# Altium project MEMC_FFC.PrjPcb
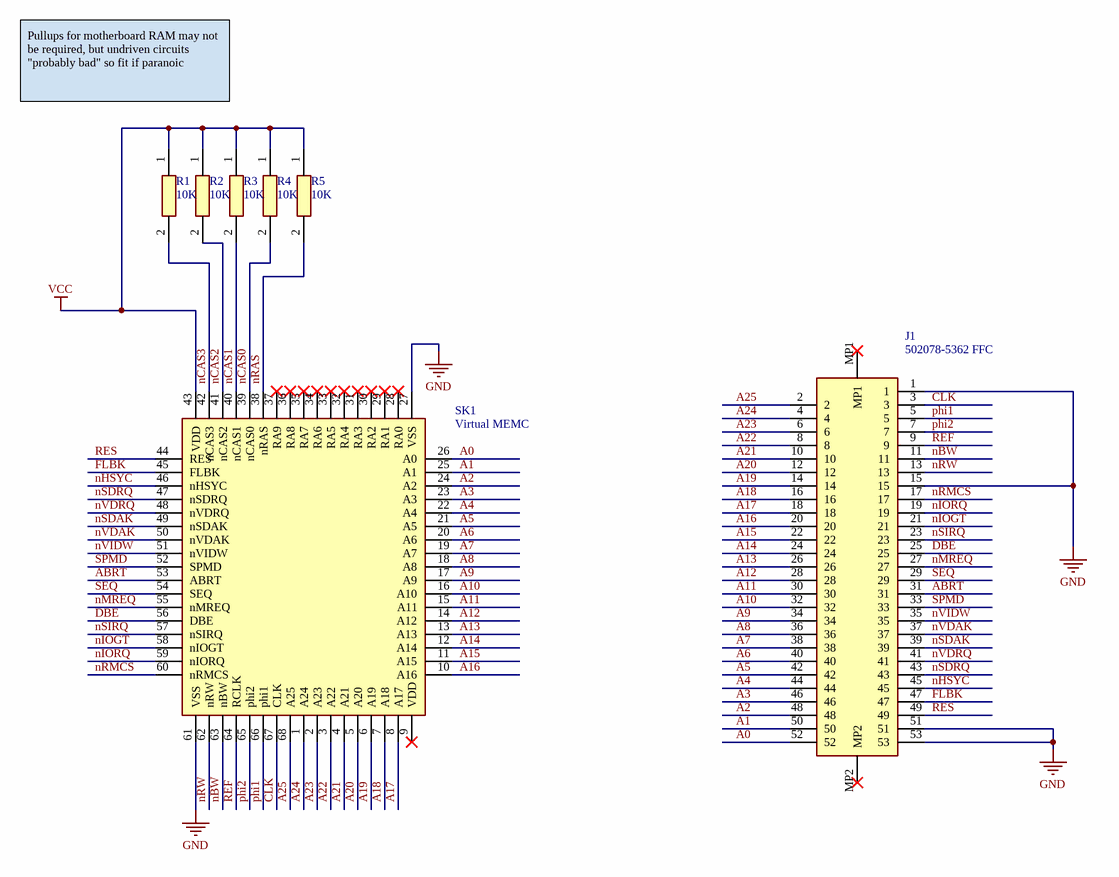
[diagram p0: MEMC_FFC.SchDoc]
Sch_RevNo: 1; Sch_ReleaseDate: 2023; Project_TItle: MEMC_FFC
1 sheet, 7 parts. Net scope: global (net labels, ports and power ports of the same name join across sheets).
Board file: MEMC_FFC.PcbDoc

## Sheet MEMC_FFC.SchDoc
size A3; SheetNumber: 1; SheetTotal: 1

### Parts
J1  502078-5362 FFC  [5020785362]
R1  10K  [RESC1005X40N]
R2  10K  [RESC1005X40N]
R3  10K  [RESC1005X40N]
R4  10K  [RESC1005X40N]
R5  10K  [RESC1005X40N]
SK1  Virtual MEMC  [846821B1RKTR]

### Nets
GND: J1.1 J1.15 J1.51 J1.53 SK1.27(VSS) SK1.61(VSS)
VCC: R1.1 R2.1 R3.1 R4.1 R5.1 SK1.43(VDD)
A0: J1.52 SK1.26(A0)
A1: J1.50 SK1.25(A1)
A2: J1.48 SK1.24(A2)
A3: J1.46 SK1.23(A3)
A4: J1.44 SK1.22(A4)
A5: J1.42 SK1.21(A5)
A6: J1.40 SK1.20(A6)
A7: J1.38 SK1.19(A7)
A8: J1.36 SK1.18(A8)
A9: J1.34 SK1.17(A9)
A10: J1.32 SK1.16(A10)
A11: J1.30 SK1.15(A11)
A12: J1.28 SK1.14(A12)
A13: J1.26 SK1.13(A13)
A14: J1.24 SK1.12(A14)
A15: J1.22 SK1.11(A15)
A16: J1.20 SK1.10(A16)
A17: J1.18 SK1.8(A17)
A18: J1.16 SK1.7(A18)
A19: J1.14 SK1.6(A19)
A20: J1.12 SK1.5(A20)
A21: J1.10 SK1.4(A21)
A22: J1.8 SK1.3(A22)
A23: J1.6 SK1.2(A23)
A24: J1.4 SK1.1(A24)
A25: J1.2 SK1.68(A25)
ABRT: J1.31 SK1.53(ABRT)
CLK: J1.3 SK1.67(CLK)
DBE: J1.25 SK1.56(DBE)
FLBK: J1.47 SK1.45(FLBK)
nBW: J1.11 SK1.63(nBW)
nCAS0: R4.2 SK1.39(nCAS0)
nCAS1: R3.2 SK1.40(nCAS1)
nCAS2: R2.2 SK1.41(nCAS2)
nCAS3: R1.2 SK1.42(nCAS3)
nHSYC: J1.45 SK1.46(nHSYC)
nIOGT: J1.21 SK1.58(nIOGT)
nIORQ: J1.19 SK1.59(nIORQ)
nMREQ: J1.27 SK1.55(nMREQ)
nRAS: R5.2 SK1.38(nRAS)
nRMCS: J1.17 SK1.60(nRMCS)
nRW: J1.13 SK1.62(nRW)
nSDAK: J1.39 SK1.49(nSDAK)
nSDRQ: J1.43 SK1.47(nSDRQ)
nSIRQ: J1.23 SK1.57(nSIRQ)
nVDAK: J1.37 SK1.50(nVDAK)
nVDRQ: J1.41 SK1.48(nVDRQ)
nVIDW: J1.35 SK1.51(nVIDW)
phi1: J1.5 SK1.66(phi1)
phi2: J1.7 SK1.65(phi2)
REF: J1.9 SK1.64(RCLK)
RES: J1.49 SK1.44(RES)
SEQ: J1.29 SK1.54(SEQ)
SPMD: J1.33 SK1.52(SPMD)

Not connected (* = marked no-connect by the designer): J1 MP1* MP2*; SK1 9(VDD)* 28(RA0)* 29(RA1)* 30(RA2)* 31(RA3)* 32(RA4)* 33(RA5)* 34(RA6)* 35(RA7)* 36(RA8)* 37(RA9)*

### Notes on the sheet
- Pullups for motherboard RAM may not be required, but undriven circuits "probably bad" so fit if paranoic
- SIZE
- CODION LTD
- DIMENSIONS
- TITLE
- VARIANT
- REVISION
- DATE
- A3
- SHEET
- OF
- FILE
- DRAWN BY

### Library data of the parts
J1 = 502078-5362: Connector; Manufacturer_Name: Molex; Datasheet Link: https://componentsearchengine.com/Datasheets/1/502078-5362.pdf; Height: 1.15mm; Manufacturer_Part_Number: 502078-5362; Mouser Part Number: 538-502078-5362; Mouser Price/Stock: https://www.mouser.com/Search/Refine.aspx?Keyword=538-502078-5362
R1-R5 = CRCW040210K0FKEDHP: Resistor; Manufacturer_Name: Vishay; Datasheet Link: http://www.vishay.com/docs/20035/dcrcwe3.pdf; Height: 0.4mm; Manufacturer_Part_Number: CRCW040210K0FKEDHP; Mouser Part Number: 71-CRCW040210K0FKEDH; Mouser Price/Stock: https://www.mouser.co.uk/ProductDetail/Vishay-Dale/CRCW040210K0FKEDHP?qs=FlFvgi4rxBxmIiaeyFjrkA%3D%3D; Arrow Part Number: CRCW040210K0FKEDHP; Arrow Price/Stock: https://www.arrow.com/en/products/crcw040210k0fkedhp/vishay?region=nac
SK1 = MEMC_Skt: MEMC socket; Manufacturer_Name: 3M; Manufacturer_Part_Number: 8468-21B1-RK-TR; Datasheet Link: https://www.arrow.com/en/products/8468-21b1-rk-tr/3m; Height: 4.6mm; Mouser Part Number: 517-8468-21B1-RK-TR; Mouser Price/Stock: https://www.mouser.co.uk/ProductDetail/3M-Electronic-Solutions-Division/8468-21B1-RK-TR?qs=X%2F%2F06fXhnJ18zOj3KK47CQ%3D%3D; Arrow Part Number: 8468-21B1-RK-TR; Arrow Price/Stock: https://www.arrow.com/en/products/8468-21b1-rk-tr/3m

## Assembly variants
STD: not fitted J1 J2 J3 J4